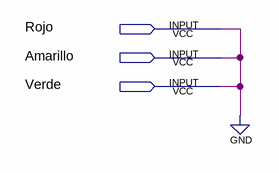
[diagram p0: schematic sheet]
// Quartus schematic Tp2Grupo3_Semaforo.bdf as structural Verilog: 0 symbols, 3 pins
module Tp2Grupo3_Semaforo (
  input  Rojo,
  input  Amarillo,
  input  Verde
);


  assign Rojo = Amarillo;
  assign Verde = Amarillo;
  // also tied to GND on the sheet: Amarillo
endmodule
